# Altium project 学生电源.PRJPCB
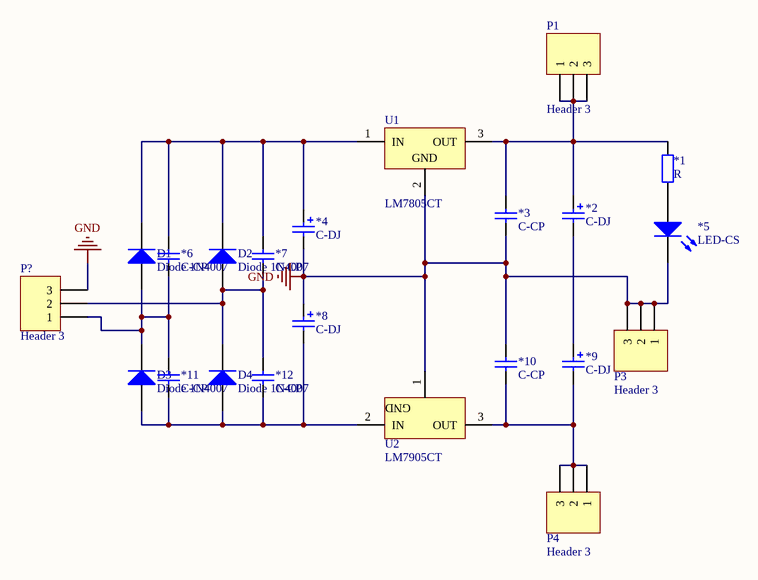
[diagram p0: 学生电源.SchDoc]
1 sheet, 22 parts. Net scope: global (net labels, ports and power ports of the same name join across sheets).
Board file: 学生电源.PcbDoc

## Sheet 学生电源.SchDoc
size A4

### Parts
*1  R  [电阻-2W]
*2  C-DJ  [电解电容-10mm]
*3  C-CP  [瓷片电容]
*4  C-DJ  [电解电容-10mm]
*5  LED-CS  [LED-5]
*6  C-CP  [瓷片电容]
*7  C-CP  [瓷片电容]
*8  C-DJ  [电解电容-10mm]
*9  C-DJ  [电解电容-10mm]
*10  C-CP  [瓷片电容]
*11  C-CP  [瓷片电容]
*12  C-CP  [瓷片电容]
D1  Diode 1N4007  [DO-41]
D2  Diode 1N4007  [DO-41]
D3  Diode 1N4007  [DO-41]
D4  Diode 1N4007  [DO-41]
P1  Header 3  [HDR1X3]
P3  Header 3  [HDR1X3]
P4  Header 3  [HDR1X3]
P?  Header 3  [HDR1X3]
U1  LM7805CT  [T03B]
U2  LM7905CT  [T03B]

### Nets
GND: *3.1 *4.2 *5.2(K) *8.1 *10.2 P3.1 P3.2 P3.3 P?.3 U1.2(GND) U2.1(GND)
Net*1_1: *1.1 *5.1(A)
Net*1_2: *1.2 *2.1 *3.2 P1.1 P1.2 P1.3 U1.3(OUT)
Net*2_2: *2.2 *9.1
Net*4_1: *4.1 *6.2 *7.2 D1.2(K) D2.2(K) U1.1(IN)
Net*6_1: *6.1 *11.2 D1.1(A) D3.2(K) P?.1
Net*7_1: *7.1 *12.2 D2.1(A) D4.2(K) P?.2
Net*8_2: *8.2 *11.1 *12.1 D3.1(A) D4.1(A) U2.2(IN)
Net*9_2: *9.2 *10.1 P4.1 P4.2 P4.3 U2.3(OUT)

### Library data of the parts
D1-D4 = Diode 1N4007: 1 Amp General Purpose Rectifier; Published: 8-Jun-2000; LatestRevisionDate: 17-Jul-2002; LatestRevisionNote: Re-released for DXP Platform.; DatasheetDocument: 1998; PackageDocument: Aug-1999; PackageReference: DO-41; Publisher: Altium Limited; Code_JEDEC: DO-204-AL; ComponentLink1Description: Manufacturer Link; ComponentLink1URL: http://www.fairchildsemi.com/; ComponentLink2Description: Datasheet; ComponentLink2URL: http://www.fairchildsemi.com/ds/1N%2F1N4001.pdf
P1 P3 P4 P? = Header 3: Header, 3-Pin; LatestRevisionDate: 17-Jul-2002; LatestRevisionNote: Re-released for DXP Platform.; Publisher: Altium Limited
U1 = LM7805CT: Series 3-Terminal Positive Regulator; Note: Tab is connected to GND; Published: 15-Apr-2002; DatasheetVersion: May-1999; PackageVersion: 1995; PackageReference: T03B; Publisher: Altium Limited; PackageDescription: TO, Thru-Hole, Vertical, Heatsink Mounted; 3 In-Line Leads; Pitch 2.54 mm; ComponentLink1Description: Manufacturer Link; ComponentLink1URL: http://www.national.com/; ComponentLink2Description: Datasheet; ComponentLink2URL: http://www.national.com/ds.cgi/LM/LM7512C.pdf; ComponentLink3Description: URL Link1; ComponentLink3URL: http://www.national.com/pf/LM/LM7805C.html
U2 = LM7905CT: 3-Terminal Negative Regulator; Note: Tab is connected to Input; Published: 15-Apr-2002; DatasheetVersion: Jun-1999; PackageVersion: 1995; PackageReference: T03B; Publisher: Altium Limited; PackageDescription: TO, Thru-Hole, Vertical, Heatsink Mounted; 3 In-Line Leads; Pitch 2.54 mm; ComponentLink1Description: Manufacturer Link; ComponentLink1URL: http://www.national.com/; ComponentLink2Description: Datasheet; ComponentLink2URL: http://www.national.com/ds.cgi/LM/LM7905.pdf; ComponentLink3Description: URL Link1; ComponentLink3URL: http://www.national.com/pf/LM/LM7905.html